# EasyEDA Pro project ProProject_2024电赛备赛清单_Wang01_2024-08-05.epro, board PCB4
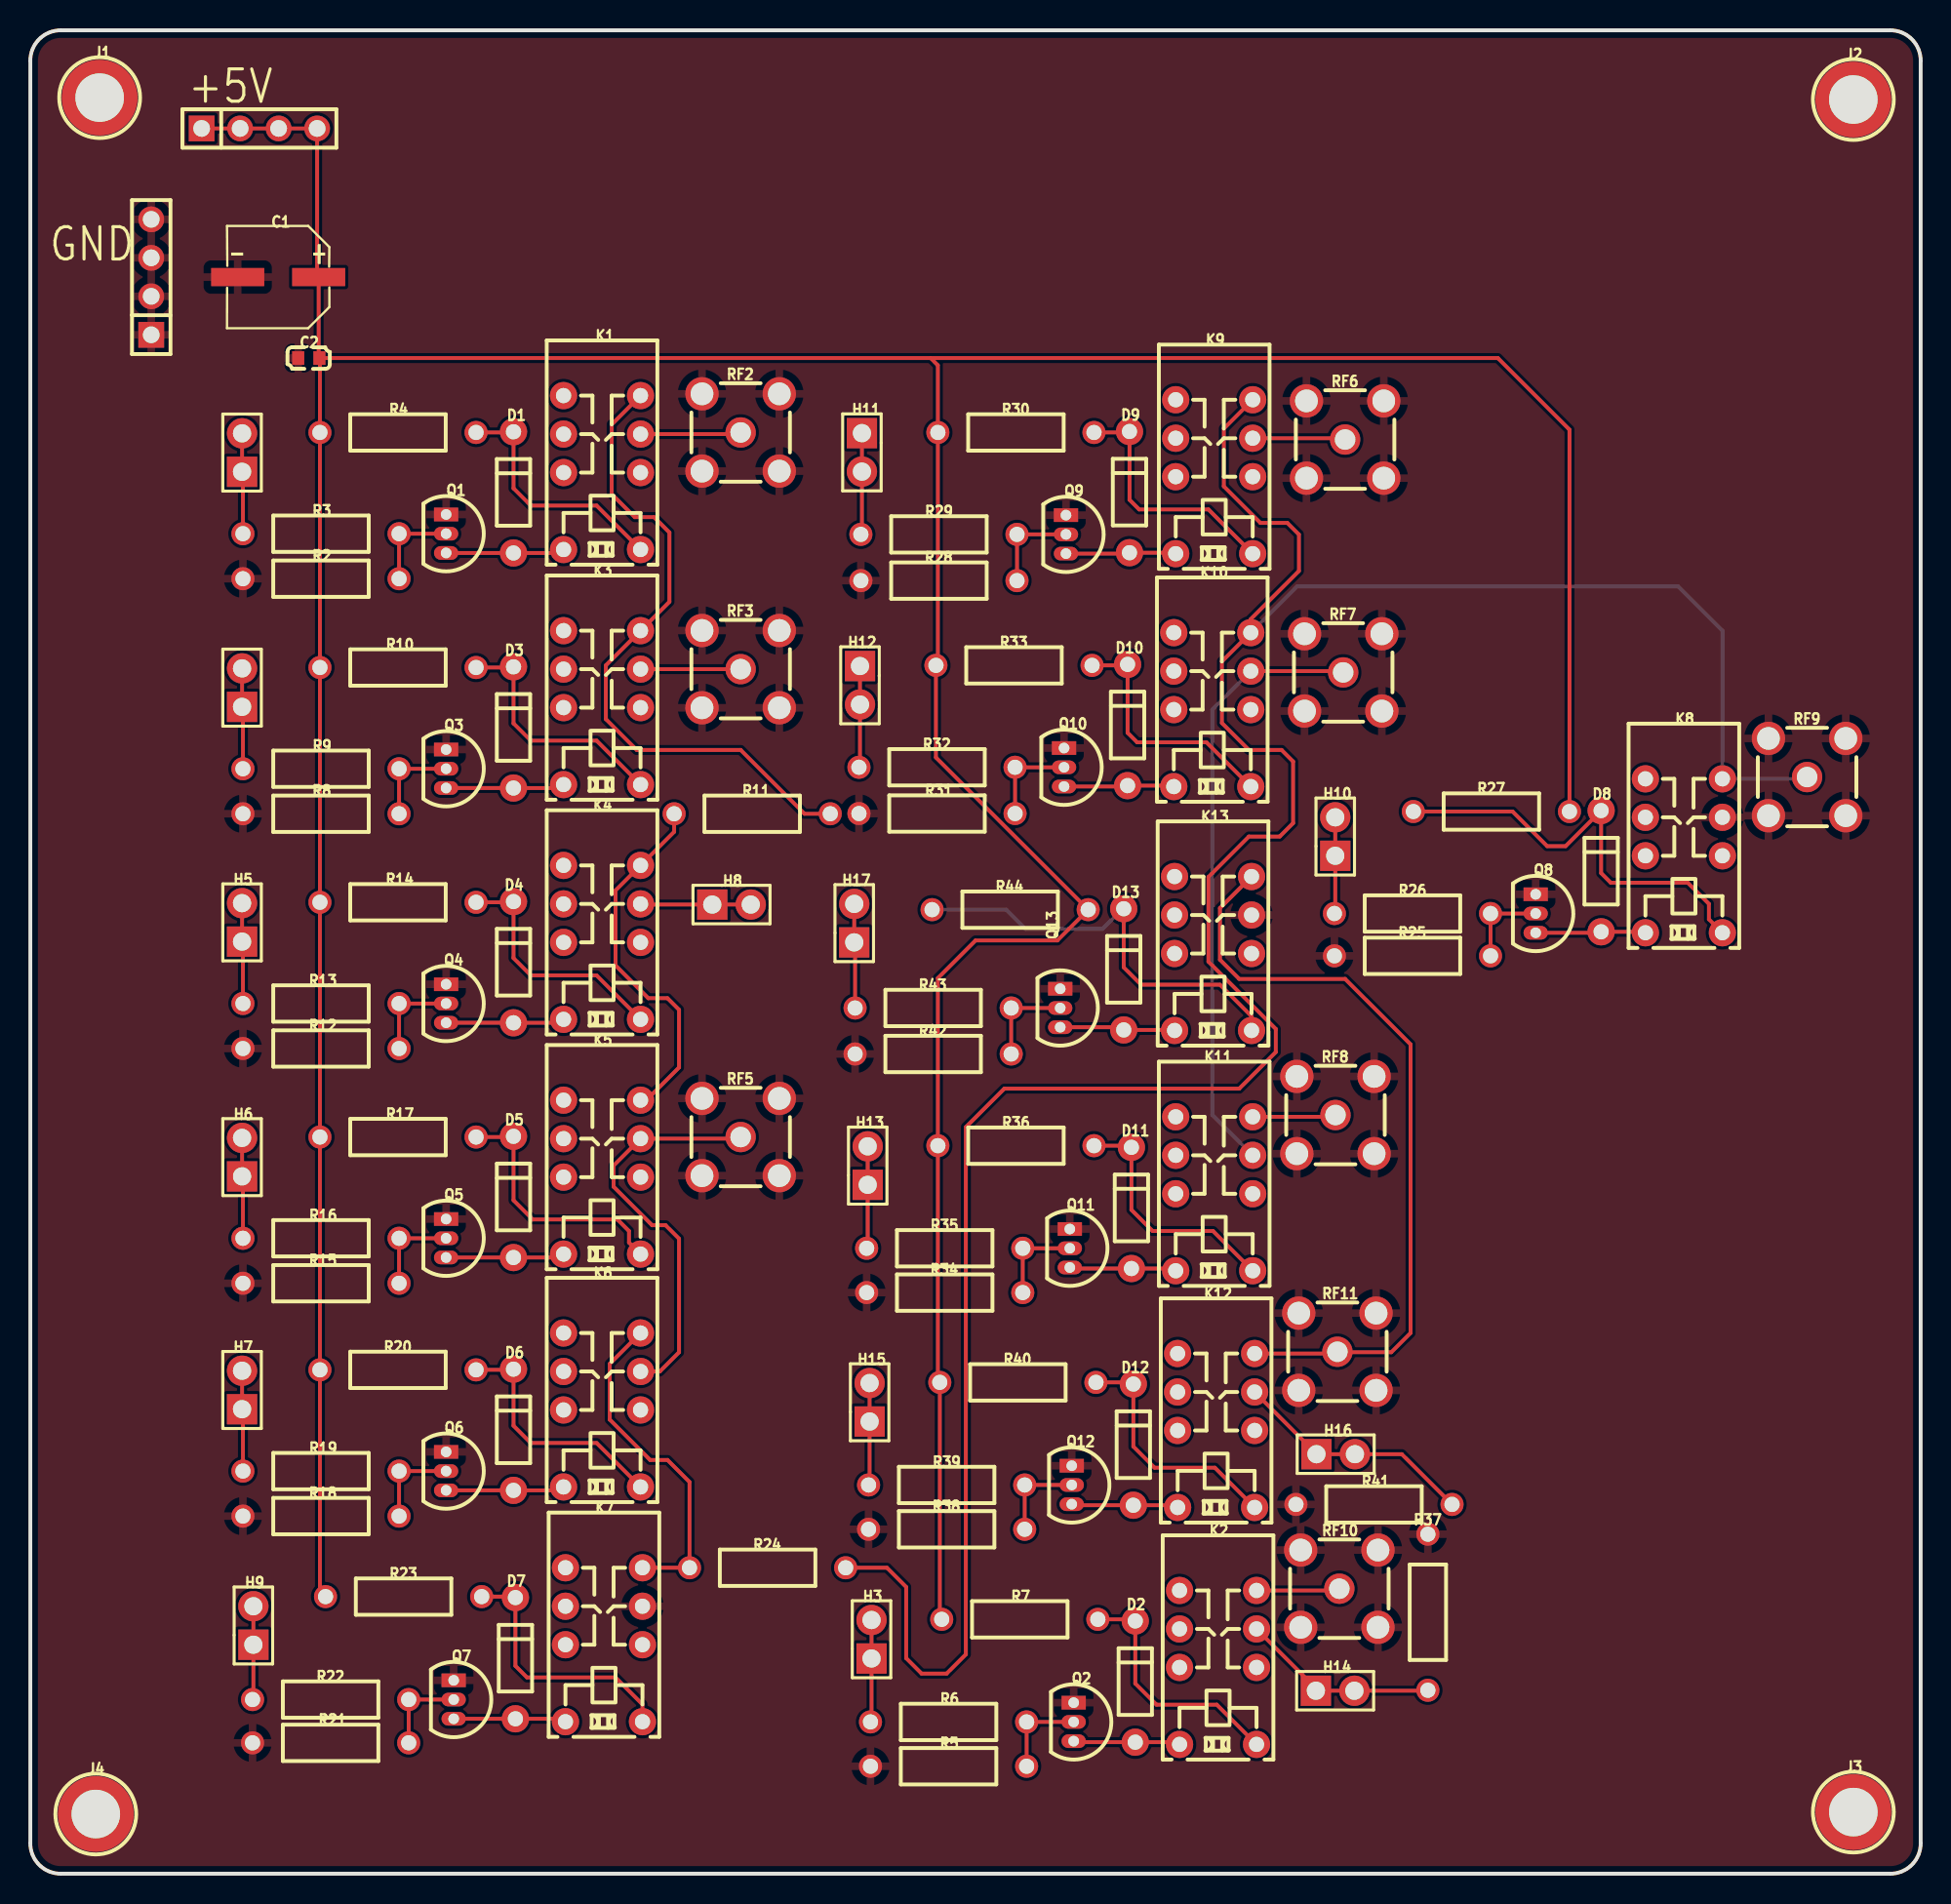
[diagram p14: board, top side]
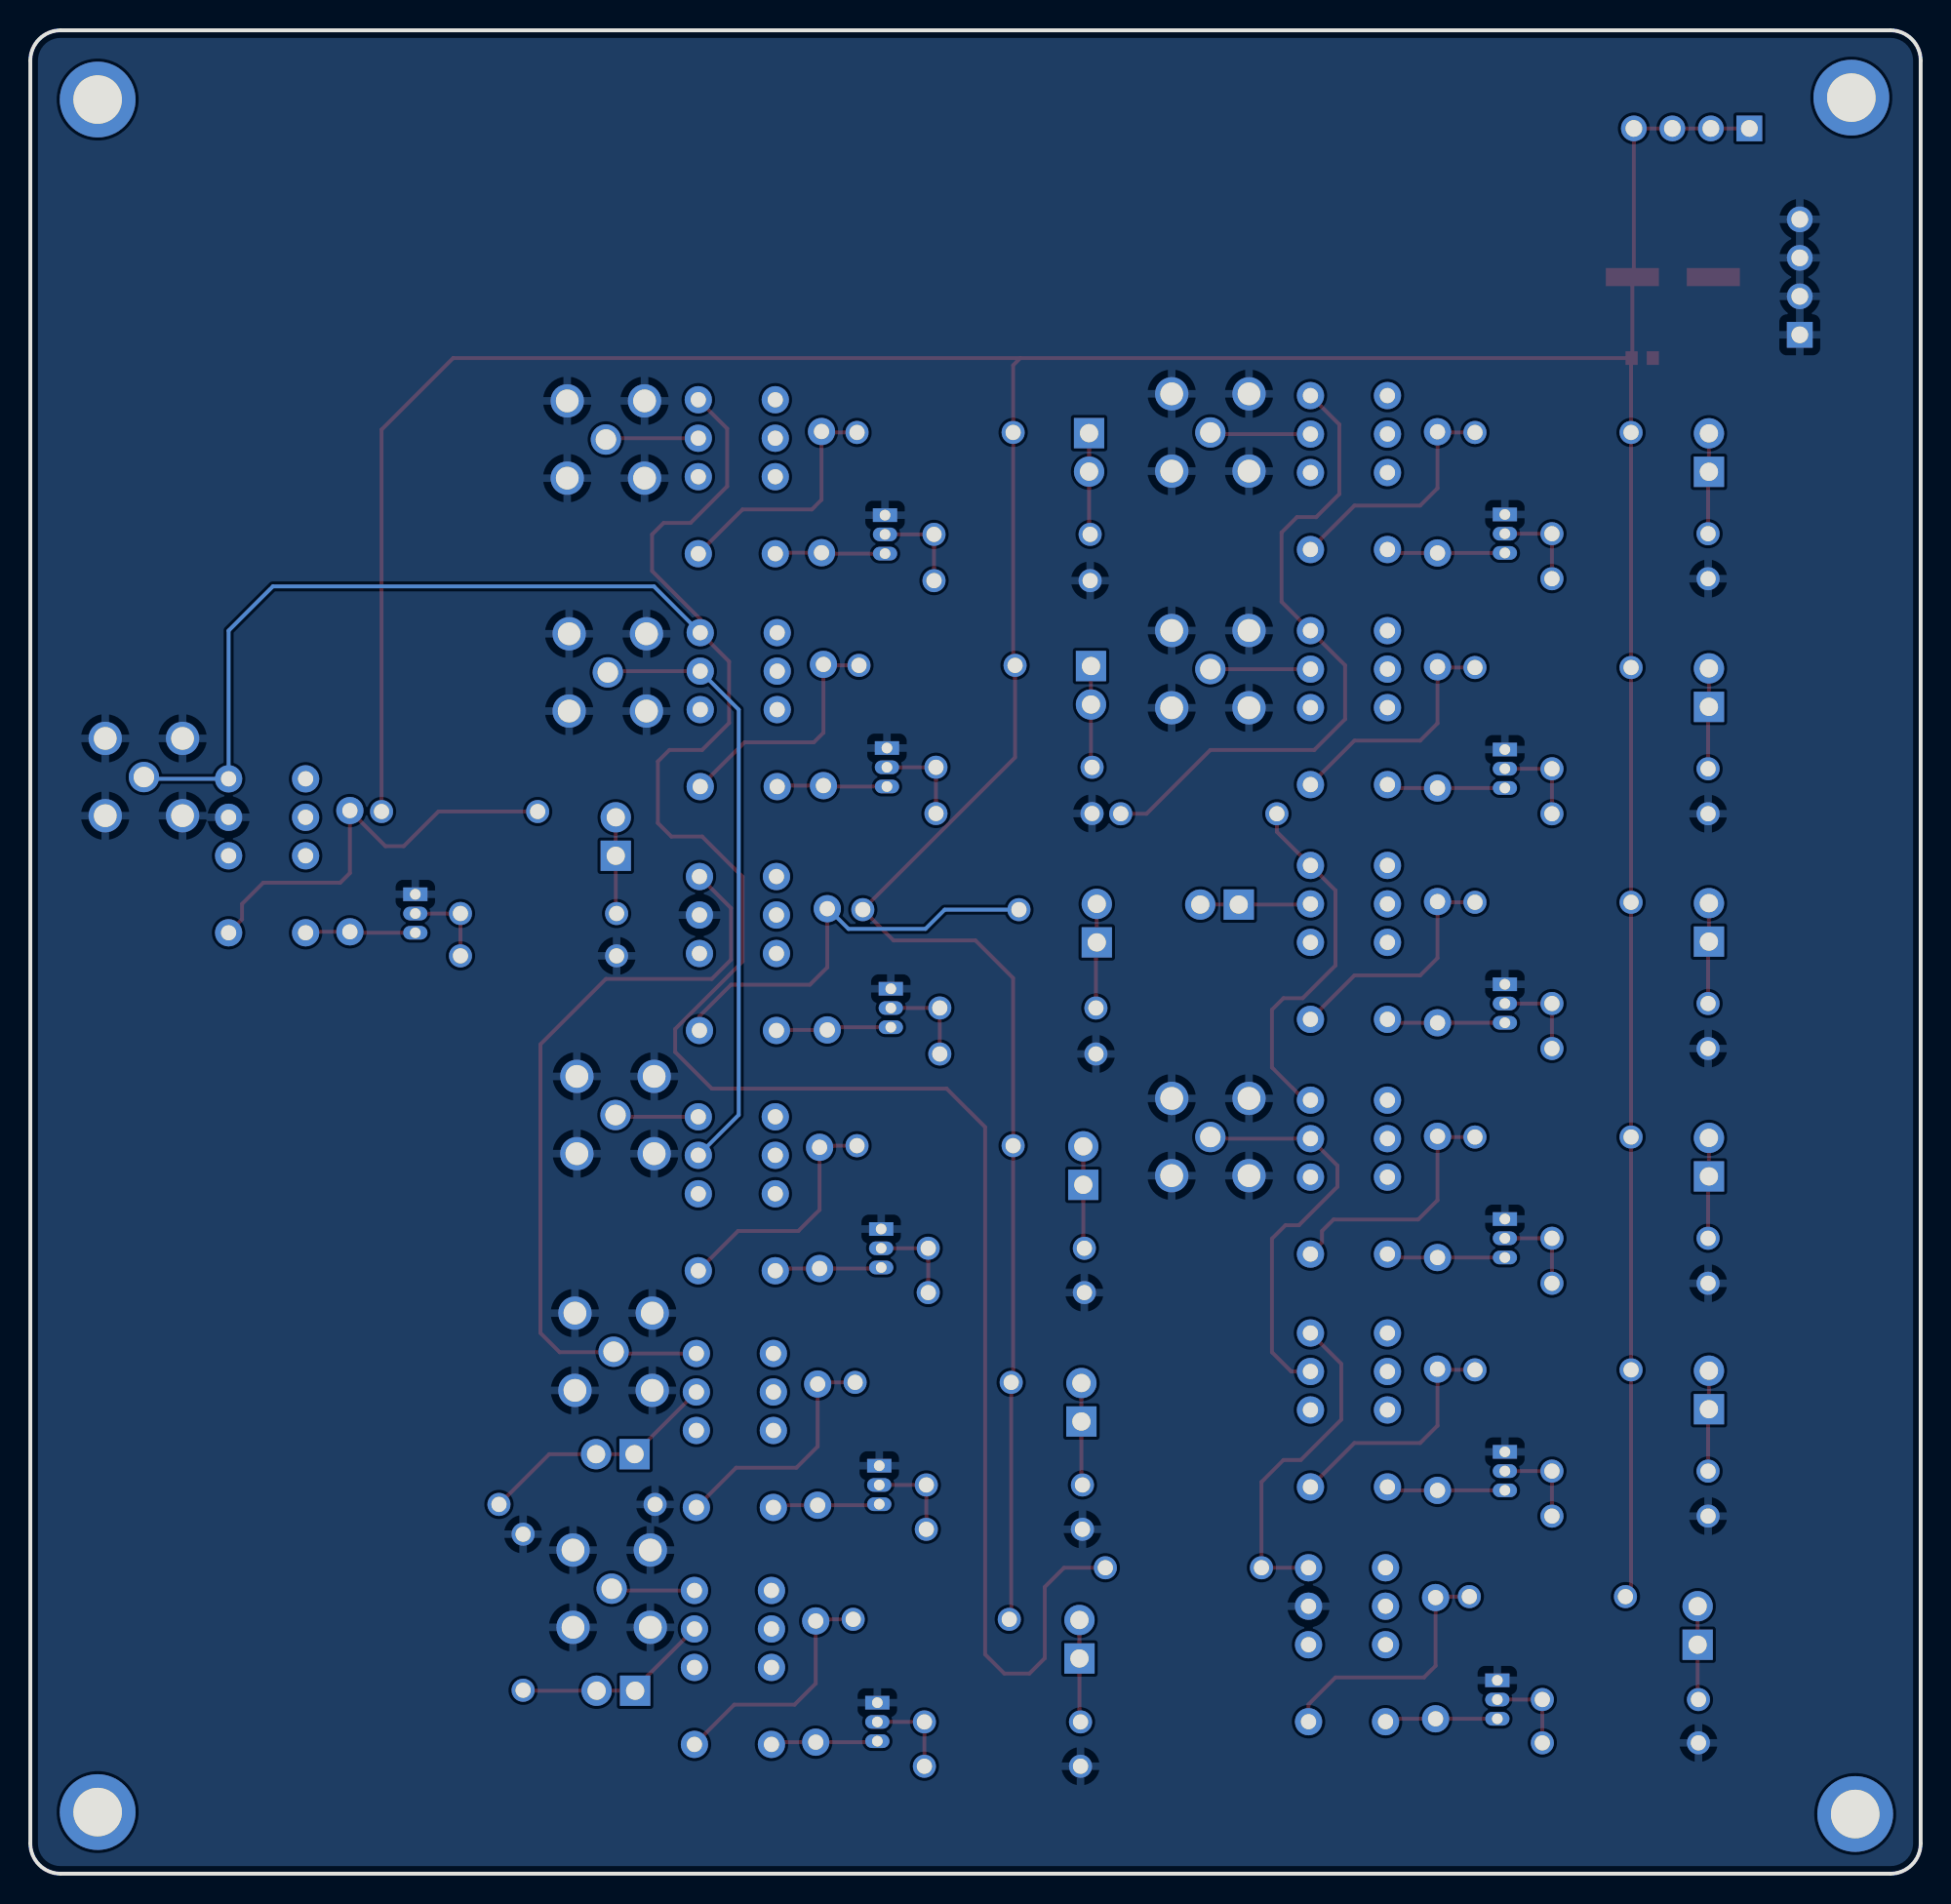
[diagram p15: board, bottom side, seen from below]

Outline 124.71 x 121.67 mm; copper layers: Top Layer, Bottom Layer. Coordinates in mm from the lower left corner of the outline.
Outline path: 0,119.67 0,2 arc(0.59,0.59) 2,0 122.71,0 arc(124.13,0.59) 124.71,2 124.71,119.67 arc(124.13,121.08) 122.71,121.67 2,121.67 arc(0.59,121.08) 0,119.67
Stack: Top Layer 0.035mm / Dielectric1 1.51mm FR4 er 4.5 / Bottom Layer 0.035mm

## Design rules (mm)
template: JLCPCB Capability(Two Layers Board)
spacing copperThickness1oz (default): track to track 0.102, other pairs 0.152 to 0.3
spacing copperThickness2oz: track to track 0.203, other pairs 0.152 to 0.3
track width copperThickness1oz (default): min 0.127, default 0.254, max 2.54
track width copperThickness2oz: min 0.203, default 0.254, max 2.54
differential pair differentialPair (default): width min 0.127, default 0.254, max 2.54; gap min 0.152, default 0.152
via viaSize (default): diameter min 0.5, default 0.61, max 10; hole min 0.3, default 0.305, max 6.3

## Placement (name value [footprint] x y rotation side)
C1  220uF  [CAP-SMD_BD6.3-L6.6-W6.6-FD]  16.35 105.38 180 top
C2  100nF  [C0603]  18.37 100.03 0 top
D1  1N4148  [DO-35_BD2.0-L4.0-P8.00-D0.5-FD]  31.88 91.17 90 top
D2  1N4148  [DO-35_BD2.0-L4.0-P8.00-D0.5-FD]  72.9 12.68 90 top
D3  1N4148  [DO-35_BD2.0-L4.0-P8.00-D0.5-FD]  31.88 75.66 90 top
D4  1N4148  [DO-35_BD2.0-L4.0-P8.00-D0.5-FD]  31.88 60.16 90 top
D5  1N4148  [DO-35_BD2.0-L4.0-P8.00-D0.5-FD]  31.88 44.67 90 top
D6  1N4148  [DO-35_BD2.0-L4.0-P8.00-D0.5-FD]  31.88 29.3 90 top
D7  1N4148  [DO-35_BD2.0-L4.0-P8.00-D0.5-FD]  32 14.22 90 top
D8  1N4148  [DO-35_BD2.0-L4.0-P8.00-D0.5-FD]  103.63 66.17 90 top
D9  1N4148  [DO-35_BD2.0-L4.0-P8.00-D0.5-FD]  72.52 91.19 90 top
D10  1N4148  [DO-35_BD2.0-L4.0-P8.00-D0.5-FD]  72.39 75.81 90 top
D11  1N4148  [DO-35_BD2.0-L4.0-P8.00-D0.5-FD]  72.64 43.94 90 top
D12  1N4148  [DO-35_BD2.0-L4.0-P8.00-D0.5-FD]  72.77 28.32 90 top
D13  1N4148  [DO-35_BD2.0-L4.0-P8.00-D0.5-FD]  72.14 59.69 90 top
H2  PZ254V-11-02P  [HDR-TH_2P-P2.54-V-M]  13.97 93.8 90 top
H3  PZ254V-11-02P  [HDR-TH_2P-P2.54-V-M]  55.5 15.47 90 top
H4  PZ254V-11-02P  [HDR-TH_2P-P2.54-V-M]  13.97 78.28 90 top
H5  PZ254V-11-02P  [HDR-TH_2P-P2.54-V-M]  13.97 62.79 90 top
H6  PZ254V-11-02P  [HDR-TH_2P-P2.54-V-M]  13.97 47.29 90 top
H7  PZ254V-11-02P  [HDR-TH_2P-P2.54-V-M]  13.97 31.93 90 top
H8  PZ254V-11-02P  [HDR-TH_2P-P2.54-V-M]  46.26 63.96 0 top
H9  PZ254V-11-02P  [HDR-TH_2P-P2.54-V-M]  14.72 16.38 90 top
H10  PZ254V-11-02P  [HDR-TH_2P-P2.54-V-M]  86.09 68.45 90 top
H11  PZ254V-11-02P  [HDR-TH_2P-P2.54-V-M]  54.86 93.81 270 top
H12  PZ254V-11-02P  [HDR-TH_2P-P2.54-V-M]  54.74 78.44 270 top
H13  PZ254V-11-02P  [HDR-TH_2P-P2.54-V-M]  55.25 46.74 90 top
H14  PZ254V-11-02P  [HDR-TH_2P-P2.54-V-M]  86.08 12.08 0 top
H15  PZ254V-11-02P  [HDR-TH_2P-P2.54-V-M]  55.37 31.11 90 top
H16  PZ254V-11-02P  [HDR-TH_2P-P2.54-V-M]  86.12 27.69 0 top
H17  PZ254V-11-02P  [HDR-TH_2P-P2.54-V-M]  54.36 62.74 90 top
H18  PZ254V-11-04P  [HDR-TH_4P-P2.54-V-M]  15.11 115.19 0 top
H19  PZ254V-11-04P  [HDR-TH_4P-P2.54-V-M]  7.98 105.38 90 top
J1  -  [M3固定孔]  4.57 117.1 0 top
J2  -  [M3固定孔]  120.27 116.97 0 top
J3  -  [M3固定孔]  120.27 3.94 0 top
J4  -  [M3固定孔]  4.32 3.81 0 top
K1  G6S-2 DC5  [RELAY-TH_G6S-2-X]  37.72 92.48 90 top
K2  G6S-2 DC5  [RELAY-TH_G6S-2-X]  78.36 13.61 90 top
K3  G6S-2 DC5  [RELAY-TH_G6S-2-X]  37.72 76.96 90 top
K4  G6S-2 DC5  [RELAY-TH_G6S-2-X]  37.72 61.47 90 top
K5  G6S-2 DC5  [RELAY-TH_G6S-2-X]  37.72 45.97 90 top
K6  G6S-2 DC5  [RELAY-TH_G6S-2-X]  37.72 30.61 90 top
K7  G6S-2 DC5  [RELAY-TH_G6S-2-X]  37.85 15.11 90 top
K8  G6S-2 DC5  [RELAY-TH_G6S-2-X]  109.09 67.18 90 top
K9  G6S-2 DC5  [RELAY-TH_G6S-2-X]  78.1 92.2 90 top
K10  G6S-2 DC5  [RELAY-TH_G6S-2-X]  77.98 76.83 90 top
K11  G6S-2 DC5  [RELAY-TH_G6S-2-X]  78.1 44.88 90 top
K12  G6S-2 DC5  [RELAY-TH_G6S-2-X]  78.23 29.25 90 top
K13  G6S-2 DC5  [RELAY-TH_G6S-2-X]  78.03 60.73 90 top
Q1  SS8050  [TO-92-3_L4.9-W3.7-P1.27-L]  27.43 88.44 270 top
Q2  SS8050  [TO-92-3_L4.9-W3.7-P1.27-L]  68.83 10.02 270 top
Q3  SS8050  [TO-92-3_L4.9-W3.7-P1.27-L]  27.43 72.93 270 top
Q4  SS8050  [TO-92-3_L4.9-W3.7-P1.27-L]  27.43 57.43 270 top
Q5  SS8050  [TO-92-3_L4.9-W3.7-P1.27-L]  27.43 41.94 270 top
Q6  SS8050  [TO-92-3_L4.9-W3.7-P1.27-L]  27.43 26.57 270 top
Q7  SS8050  [TO-92-3_L4.9-W3.7-P1.27-L]  27.93 11.49 270 top
Q8  SS8050  [TO-92-3_L4.9-W3.7-P1.27-L]  99.31 63.37 270 top
Q9  SS8050  [TO-92-3_L4.9-W3.7-P1.27-L]  68.33 88.4 270 top
Q10  SS8050  [TO-92-3_L4.9-W3.7-P1.27-L]  68.2 73.03 270 top
Q11  SS8050  [TO-92-3_L4.9-W3.7-P1.27-L]  68.58 41.28 270 top
Q12  SS8050  [TO-92-3_L4.9-W3.7-P1.27-L]  68.71 25.66 270 top
Q13  SS8050  [TO-92-3_L4.9-W3.7-P1.27-L]  67.94 57.14 270 top
R2  10kΩ  [RES-TH_BD2.4-L6.3-P10.30-D0.6]  19.18 85.47 0 top
R3  2kΩ  [RES-TH_BD2.4-L6.3-P10.30-D0.6]  19.18 88.44 0 top
R4  10Ω  [RES-TH_BD2.4-L6.3-P10.30-D0.6]  24.26 95.12 180 top
R5  10kΩ  [RES-TH_BD2.4-L6.3-P10.30-D0.6]  60.58 7.09 0 top
R6  2kΩ  [RES-TH_BD2.4-L6.3-P10.30-D0.6]  60.58 10.02 0 top
R7  10Ω  [RES-TH_BD2.4-L6.3-P10.30-D0.6]  65.28 16.79 180 top
R8  10kΩ  [RES-TH_BD2.4-L6.3-P10.30-D0.6]  19.18 69.96 0 top
R9  2kΩ  [RES-TH_BD2.4-L6.3-P10.30-D0.6]  19.18 72.93 0 top
R10  10Ω  [RES-TH_BD2.4-L6.3-P10.30-D0.6]  24.26 79.61 180 top
R11  150Ω  [RES-TH_BD2.4-L6.3-P10.30-D0.6]  47.62 69.96 0 top
R12  10kΩ  [RES-TH_BD2.4-L6.3-P10.30-D0.6]  19.18 54.46 0 top
R13  2kΩ  [RES-TH_BD2.4-L6.3-P10.30-D0.6]  19.18 57.43 0 top
R14  10Ω  [RES-TH_BD2.4-L6.3-P10.30-D0.6]  24.26 64.12 180 top
R15  10kΩ  [RES-TH_BD2.4-L6.3-P10.30-D0.6]  19.18 38.97 0 top
R16  2kΩ  [RES-TH_BD2.4-L6.3-P10.30-D0.6]  19.18 41.94 0 top
R17  10Ω  [RES-TH_BD2.4-L6.3-P10.30-D0.6]  24.26 48.62 180 top
R18  10kΩ  [RES-TH_BD2.4-L6.3-P10.30-D0.6]  19.18 23.6 0 top
R19  2kΩ  [RES-TH_BD2.4-L6.3-P10.30-D0.6]  19.18 26.57 0 top
R20  10Ω  [RES-TH_BD2.4-L6.3-P10.30-D0.6]  24.26 33.25 180 top
R21  10kΩ  [RES-TH_BD2.4-L6.3-P10.30-D0.6]  19.81 8.64 0 top
R22  2kΩ  [RES-TH_BD2.4-L6.3-P10.30-D0.6]  19.81 11.49 0 top
R23  10Ω  [RES-TH_BD2.4-L6.3-P10.30-D0.6]  24.63 18.29 180 top
R24  150Ω  [RES-TH_BD2.4-L6.3-P10.30-D0.6]  48.64 20.19 0 top
R25  10kΩ  [RES-TH_BD2.4-L6.3-P10.30-D0.6]  91.19 60.58 0 top
R26  2kΩ  [RES-TH_BD2.4-L6.3-P10.30-D0.6]  91.19 63.37 0 top
R27  10Ω  [RES-TH_BD2.4-L6.3-P10.30-D0.6]  96.39 70.1 0 top
R28  10kΩ  [RES-TH_BD2.4-L6.3-P10.30-D0.6]  59.94 85.34 0 top
R29  2kΩ  [RES-TH_BD2.4-L6.3-P10.30-D0.6]  59.94 88.4 0 top
R30  10Ω  [RES-TH_BD2.4-L6.3-P10.30-D0.6]  65.02 95.12 180 top
R31  10kΩ  [RES-TH_BD2.4-L6.3-P10.30-D0.6]  59.82 69.97 0 top
R32  2kΩ  [RES-TH_BD2.4-L6.3-P10.30-D0.6]  59.82 73.03 0 top
R33  10Ω  [RES-TH_BD2.4-L6.3-P10.30-D0.6]  64.9 79.75 180 top
R34  10kΩ  [RES-TH_BD2.4-L6.3-P10.30-D0.6]  60.32 38.35 0 top
R35  2kΩ  [RES-TH_BD2.4-L6.3-P10.30-D0.6]  60.32 41.28 0 top
R36  10Ω  [RES-TH_BD2.4-L6.3-P10.30-D0.6]  65.02 48.05 180 top
R37  4.7K  [RES-TH_BD2.4-L6.3-P10.30-D0.6]  92.2 17.26 270 top
R38  10kΩ  [RES-TH_BD2.4-L6.3-P10.30-D0.6]  60.45 22.73 0 top
R39  2kΩ  [RES-TH_BD2.4-L6.3-P10.30-D0.6]  60.45 25.66 0 top
R40  10Ω  [RES-TH_BD2.4-L6.3-P10.30-D0.6]  65.15 32.43 180 top
R41  4.7K  [RES-TH_BD2.4-L6.3-P10.30-D0.6]  88.65 24.37 0 top
R42  10kΩ  [RES-TH_BD2.4-L6.3-P10.30-D0.6]  59.56 54.1 0 top
R43  2kΩ  [RES-TH_BD2.4-L6.3-P10.30-D0.6]  59.56 57.14 0 top
R44  10Ω  [RES-TH_BD2.4-L6.3-P10.30-D0.6]  64.64 63.63 0 top
RF2  BWSMA-KE-Z001  [SMA-TH_BWSMA-KE-Z001]  46.86 95.12 0 top
RF3  BWSMA-KE-Z001  [SMA-TH_BWSMA-KE-Z001]  46.86 79.5 0 top
RF5  BWSMA-KE-Z001  [SMA-TH_BWSMA-KE-Z001]  46.86 48.62 0 top
RF6  BWSMA-KE-Z001  [SMA-TH_BWSMA-KE-Z001]  86.74 94.66 0 top
RF7  BWSMA-KE-Z001  [SMA-TH_BWSMA-KE-Z001]  86.61 79.29 0 top
RF8  BWSMA-KE-Z001  [SMA-TH_BWSMA-KE-Z001]  86.11 50.07 0 top
RF9  BWSMA-KE-Z001  [SMA-TH_BWSMA-KE-Z001]  117.22 72.38 0 top
RF10  BWSMA-KE-Z001  [SMA-TH_BWSMA-KE-Z001]  86.36 18.81 0 top
RF11  BWSMA-KE-Z001  [SMA-TH_BWSMA-KE-Z001]  86.23 34.45 0 top

## Footprints (pads in the part's own frame, mm; a bottom-side part is the same pattern mirrored in y, then rotated)
C0603
  rect 0.8x0.9 smd: 1(-0.7,0) 2(0.7,0)
CAP-SMD_BD6.3-L6.6-W6.6-FD
  rect 3.5x1.2 smd: 1(-2.67,0) 2(2.67,0)
DO-35_BD2.0-L4.0-P8.00-D0.5-FD
  round 1.8 hole 1: 1(-4,0) 2(4,0)
HDR-TH_2P-P2.54-V-M
  rect 2x2 hole 1.2: 1(-1.27,0)
  round 2 hole 1.2: 2(1.27,0)
HDR-TH_4P-P2.54-V-M
  rect 1.7x1.7 hole 1.1: 1(-3.81,0)
  round 1.7 hole 1.1: 2(-1.27,0) 3(1.27,0) 4(3.81,0)
M3固定孔
  round 5 hole 3.2: 1(0,0.127)
RELAY-TH_G6S-2-X
  round 1.8 hole 1: 1(-5.08,-2.54) 3(0,-2.54) 4(2.54,-2.54) 5(5.08,-2.54) 8(5.08,2.54) 9(2.54,2.54) 10(0,2.54) 12(-5.08,2.54)
RES-TH_BD2.4-L6.3-P10.30-D0.6
  round 1.524 hole 1: 1(-5.15,0) 2(5.15,0)
SMA-TH_BWSMA-KE-Z001
  round 2.2 hole 1.5: 1(-2.55,-2.55) 2(-2.55,2.55) 3(2.55,2.55) 4(2.55,-2.55)
  round 2 hole 1.35: 5(0,0)
TO-92-3_L4.9-W3.7-P1.27-L
  rect 0.9x1.6 hole 0.7: 1(-1.27,0)
  oval 0.9x1.6 hole 0.7: 2(0,0) 3(1.27,0)

## Nets
As in the schematic, except:
+5V: C1.1 C2.2 H18.1 H18.2 H18.3 H18.4 R4.2 R7.2 R10.2 R14.2 R17.2 R20.2 R23.2 R27.2 R30.2 R33.2 R36.2 R40.2 R44.2
GND: C1.2 C2.1 H19.1 H19.2 H19.3 H19.4 K7.4 K8.4 K13.4 Q1.1 Q2.1 Q3.1 Q4.1 Q5.1 Q6.1 Q7.1 Q8.1 Q9.1 Q10.1 Q11.1 Q12.1 Q13.1 R2.1 R5.1 R8.1 R12.1 R15.1 R18.1 R21.1 R25.1 R28.1 R31.1 R34.1 R37.1 R38.1 R41.1 R42.1 RF2.1 RF2.2 RF2.3 RF2.4 RF3.1 RF3.2 RF3.3 RF3.4 RF5.1 RF5.2 RF5.3 RF5.4 RF6.1 RF6.2 RF6.3 RF6.4 RF7.1 RF7.2 RF7.3 RF7.4 RF8.1 RF8.2 RF8.3 RF8.4 RF9.1 RF9.2 RF9.3 RF9.4 RF10.1 RF10.2 RF10.3 RF10.4 RF11.1 RF11.2 RF11.3 RF11.4

Pads without a net: J1 1; J2 1; J3 1; J4 1; K1 3 8 9 10; K2 3 8 9 10; K3 3 8 9 10; K4 3 8 9 10; K5 3 8 9 10; K6 3 8 9 10; K7 3 8 9 10; K8 3 8 9 10; K9 3 8 9 10; K10 3 8 9 10; K11 3 8 9 10; K12 3 8 9 10; K13 3 8 9 10

## Routing (per net, layer and track width the routed paths; a pad name or vN(x,y) marks a point on that pad's centre or on a via; arc(x,y) is an arc through that point)
+5V: length 309.4
  Top Layer w0.254: R27.2 101.54,95.31 96.82,100.03 59.4,100.03 ; C2.2 19.11,100 R4.2 R10.2 R14.2 R17.2 R20.2 19.11,18.66 R23.2 ; C2.2 19.02,100.08 C1.1 18.92,105.48 H18.4 H18.3 H18.2 H18.1 ; C2.2 59.4,100.03 ; R7.2 60,16.92 R40.2 59.87,32.56 R36.2 59.87,59.11 62.36,61.6 67.76,61.6 R44.2 59.75,73.67 R33.2 59.87,79.88 R30.2 59.87,99.56 59.4,100.03
A-: length 43.6
  Top Layer w0.254: R11.2 51.07,69.96 46.86,74.17 40,74.17 37.97,76.2 37.97,79.76 42.16,83.95 42.16,88.52 41.15,89.54 39.88,89.54 38.35,91.06 38.35,95.65 40.26,97.56
$1N747: length 6.1
  Top Layer w0.254: Q1.2 24.33,88.44 24.33,85.47
$1N976: length 16.3
  Top Layer w0.254: 40.26,87.4 37.36,90.3 33.02,90.3 31.88,91.44 D1.2 31.83,95.12 29.41,95.12
$1N980: length 7.8
  Top Layer w0.254: Q1.3 31.88,87.17 D1.1 34.95,87.17 K1.12
$1N1135: length 6.6
  Top Layer w0.254: H2.2 H2.1 14.03,92.47 R3.1
$1N1475: length 6
  Top Layer w0.254: Q2.2 R6.2 R5.2
$1N1479: length 16.3
  Top Layer w0.254: K2.1 78.28,11.16 74.29,11.16 72.9,12.55 D2.2 72.79,16.79 R7.1
$1N1483: length 7.1
  Top Layer w0.254: Q2.3 68.9,8.68 D2.1 75.67,8.68 75.82,8.53
$1N1489: length 6.8
  Top Layer w0.254: H3.2 H3.1 55.5,10.09 R6.1
$1N1579: length 6.6
  Top Layer w0.254: 40.26,95.02 46.76,95.02 RF2.5
$1N2713: length 6.1
  Top Layer w0.254: Q3.2 24.33,72.93 24.33,69.96
$1N2714: length 16.3
  Top Layer w0.254: 40.26,71.88 37.36,74.78 33.02,74.78 31.88,75.93 D3.2 31.83,79.61 29.41,79.61
$1N2715: length 7.8
  Top Layer w0.254: K3.12 34.95,71.66 D3.1 31.88,71.66 Q3.3
$1N2717: length 6.6
  Top Layer w0.254: R9.1 14.03,76.96 H4.1 H4.2
$1N2720: length 6.6
  Top Layer w0.254: RF3.5 40.26,79.5
$1N3255: length 6.1
  Top Layer w0.254: 24.33,54.46 24.33,57.43 Q4.2
$1N3256: length 16.3
  Top Layer w0.254: 40.26,56.39 37.36,59.29 33.02,59.29 31.88,60.43 D4.2 31.83,64.12 29.41,64.12
$1N3257: length 7.8
  Top Layer w0.254: Q4.3 31.88,56.16 D4.1 34.95,56.16 K4.12
$1N3259: length 6.6
  Top Layer w0.254: R13.1 14.03,61.46 H5.1 H5.2
$1N3674: length 6.1
  Top Layer w0.254: Q5.2 24.33,41.94 24.33,38.97
$1N3675: length 17
  Top Layer w0.254: 29.41,48.62 31.83,48.62 D5.2 31.88,44.45 33.15,43.18 38.73,43.18 39.5,42.42 39.5,41.66 40.26,40.89
$1N3676: length 7.8
  Top Layer w0.254: Q5.3 31.88,40.67 D5.1 34.95,40.67 K5.12
$1N3678: length 6.6
  Top Layer w0.254: R16.1 14.03,45.97 H6.1 H6.2
$1N3701: length 24.3
  Top Layer w0.254: R11.1 42.47,68.76 38.61,64.9 38.61,59.94 40.77,57.79 42.04,57.79 42.8,57.02 42.8,53.21 40.64,51.05 40.26,51.05
$1N5477: length 6.1
  Top Layer w0.254: Q6.2 24.33,26.57 24.33,23.6
$1N5478: length 16.3
  Top Layer w0.254: 29.41,33.25 31.83,33.25 D6.2 31.88,29.57 33.02,28.43 37.36,28.43 40.26,25.53
$1N5479: length 7.8
  Top Layer w0.254: Q6.3 31.88,25.3 D6.1 34.95,25.3 K6.12
$1N5481: length 6.6
  Top Layer w0.254: R19.1 14.03,30.6 H7.1 H7.2
$1N5539: length 7.3
  Top Layer w0.254: 40.26,64.01 40.3,63.96 H8.1 H8.2
$1N5543: length 26.9
  Top Layer w0.254: 40.26,33.15 41.53,33.15 42.8,34.42 42.8,41.91 41.91,42.8 41.02,42.8 38.48,45.34 38.48,46.74 40.26,48.51 46.76,48.51 RF5.5
$1N5923: length 5.8
  Top Layer w0.254: Q7.2 R22.2 R21.2
$1N5924: length 17.3
  Top Layer w0.254: K7.1 40.39,11.18 38.61,12.95 32.77,12.95 32,13.72 D7.2 31.94,18.29 R23.1
$1N5925: length 7.5
  Top Layer w0.254: K7.12 35.11,10.22 D7.1 Q7.3
$1N5934: length 22.3
  Top Layer w0.254: K7.5 R24.1 43.49,25.85 42.04,27.31 40.89,27.31 38.23,29.97 38.23,33.66 40.26,35.69
$1N6337: length 5.8
  Top Layer w0.254: Q8.2 R26.2 R25.2
$1N6338: length 28.7
  Top Layer w0.254: 111.63,62.1 110.74,62.99 110.74,64.01 109.35,65.41 104.27,65.41 103.63,66.04 D8.2 101.28,67.82 100.08,67.82 97.79,70.1 R27.1
$1N6339: length 7.3
  Top Layer w0.254: Q8.3 103.57,62.1 D8.1 106.49,62.17 K8.12
$1N6689: length 6.3
  Top Layer w0.254: Q9.2 R29.2 R28.2
$1N6690: length 16.5
  Top Layer w0.254: 80.65,87.12 77.72,90.04 73.15,90.04 72.52,90.68 D9.2 72.45,95.12 R30.1
$1N6691: length 7.3
  Top Layer w0.254: K9.12 75.5,87.19 D9.1 72.46,87.13 Q9.3
$1N6816: length 6.1
  Top Layer w0.254: 80.65,94.74 86.66,94.74 RF6.5
$1N7211: length 6.3
  Top Layer w0.254: R31.2 R32.2 Q10.2
$1N7212: length 16.5
  Top Layer w0.254: K10.1 77.6,74.67 73.03,74.67 72.39,75.31 D10.2 72.33,79.75 R33.1
$1N7213: length 7.3
  Top Layer w0.254: Q10.3 72.33,71.76 D10.1 75.37,71.81 K10.12
$1N7776: length 6
  Top Layer w0.254: R34.2 R35.2 Q11.2
$1N7777: length 16.3
  Top Layer w0.254: R36.1 72.54,48.05 D11.2 72.64,43.82 74.04,42.42 78.02,42.42 80.65,39.8
$1N7778: length 7.1
  Top Layer w0.254: Q11.3 68.65,39.94 D11.1 75.42,39.94 K11.12
$1N7800: length 40.2
  Top Layer w0.254: K10.4 86.53,79.37 RF7.5
  Bottom Layer w0.254: 80.65,47.42 77.98,50.08 77.98,76.83 K10.4
$1N7895: length 5.5
  Top Layer w0.254: 80.65,49.96 85.99,49.96 RF8.5
$1N8147: length 178
  Top Layer w0.254: 80.65,97.28 78.74,95.38 78.74,91.57 81.15,89.15 82.93,89.15 83.69,88.39 83.69,85.98 80.52,82.8 K10.5 78.61,80.01 78.61,75.95 80.39,74.17 82.55,74.17 83.31,73.41 83.31,69.34 82.42,68.45 80.39,68.45 77.72,65.79 77.72,60.2 82.17,55.75 82.17,54.23 79.76,51.82 64.26,51.82 61.72,49.28 61.72,14.48 60.45,13.21 58.8,13.21 57.78,14.22 57.78,18.92 56.52,20.19 R24.2
  Bottom Layer w0.254: RF9.5 117.1,72.26 111.63,72.26 111.63,82.04 108.71,84.96 83.57,84.96 K10.5
$1N8286: length 13.1
  Top Layer w0.254: R37.2 92.17,12.08 H14.2 H14.1 84.81,12.24 K2.4
$1N8433: length 5.5
  Top Layer w0.254: RF10.5 86.24,18.69 K2.5
$1N8924: length 6
  Top Layer w0.254: Q12.2 R39.2 R38.2
$1N8925: length 16.3
  Top Layer w0.254: K12.1 78.15,26.8 74.17,26.8 72.77,28.19 D12.2 72.66,32.43 R40.1
$1N8926: length 7.1
  Top Layer w0.254: K12.12 75.55,24.32 D12.1 68.78,24.32 Q12.3
$1N8928: length 6.8
  Top Layer w0.254: R39.1 55.37,25.73 H15.1 55.37,32.38
$1N8929: length 16.1
  Top Layer w0.254: K12.4 84.85,27.72 H16.1 H16.2 90.48,27.69 R41.2
$1N9945: length 6.3
  Top Layer w0.254: R42.2 R43.2 Q13.2
$1N9946: length 28.3
  Top Layer w0.254: D13.2 72.14,59.82 73.28,58.67 78.49,58.67 80.57,56.59 K13.1
  Bottom Layer w0.254: R44.1 64.39,63.63 65.66,62.36 70.74,62.36 72.07,63.69 D13.2
$1N9947: length 7.6
  Top Layer w0.254: K13.12 75.45,55.69 D13.1 71.96,55.87 Q13.3
$1N9949: length 6.9
  Top Layer w0.254: H17.2 H17.1 54.41,61.41 54.41,57.14
$1N9969: length 51.2
  Top Layer w0.254: K13.5 78.49,63.73 78.49,60.33 79.76,59.06 86.74,59.06 91.06,54.74 91.06,35.69 89.79,34.42 86.27,34.42 RF11.5 86.12,34.33 K12.5
$1N13542: length 6.2
  Top Layer w0.254: H9.2 H9.1 14.72,11.55 R22.1
$1N13548: length 6.4
  Top Layer w0.254: R26.1 86.09,63.43 H10.1 H10.2
$1N13561: length 6.7
  Top Layer w0.254: R29.1 54.86,88.47 H11.2 H11.1
$1N13567: length 6.7
  Top Layer w0.254: R32.1 54.74,73.1 H12.2 H12.1
$1N13573: length 6.8
  Top Layer w0.254: H13.2 H13.1 55.25,41.35 R35.1

## Copper pours and planes (outline as drawn; the poured copper is in the pictures)
GND on Top Layer: -0.12,121.54 124.59,121.54 124.59,-0.12 -0.12,-0.12
GND on Bottom Layer: -0.12,121.54 124.59,121.54 124.59,-0.12 -0.12,-0.12

## Text on the board
Top Silkscreen Layer: GND | +5V
